# EAGLE design PCB-BI8-1x8SC3 (EAGLE 7.5.0)
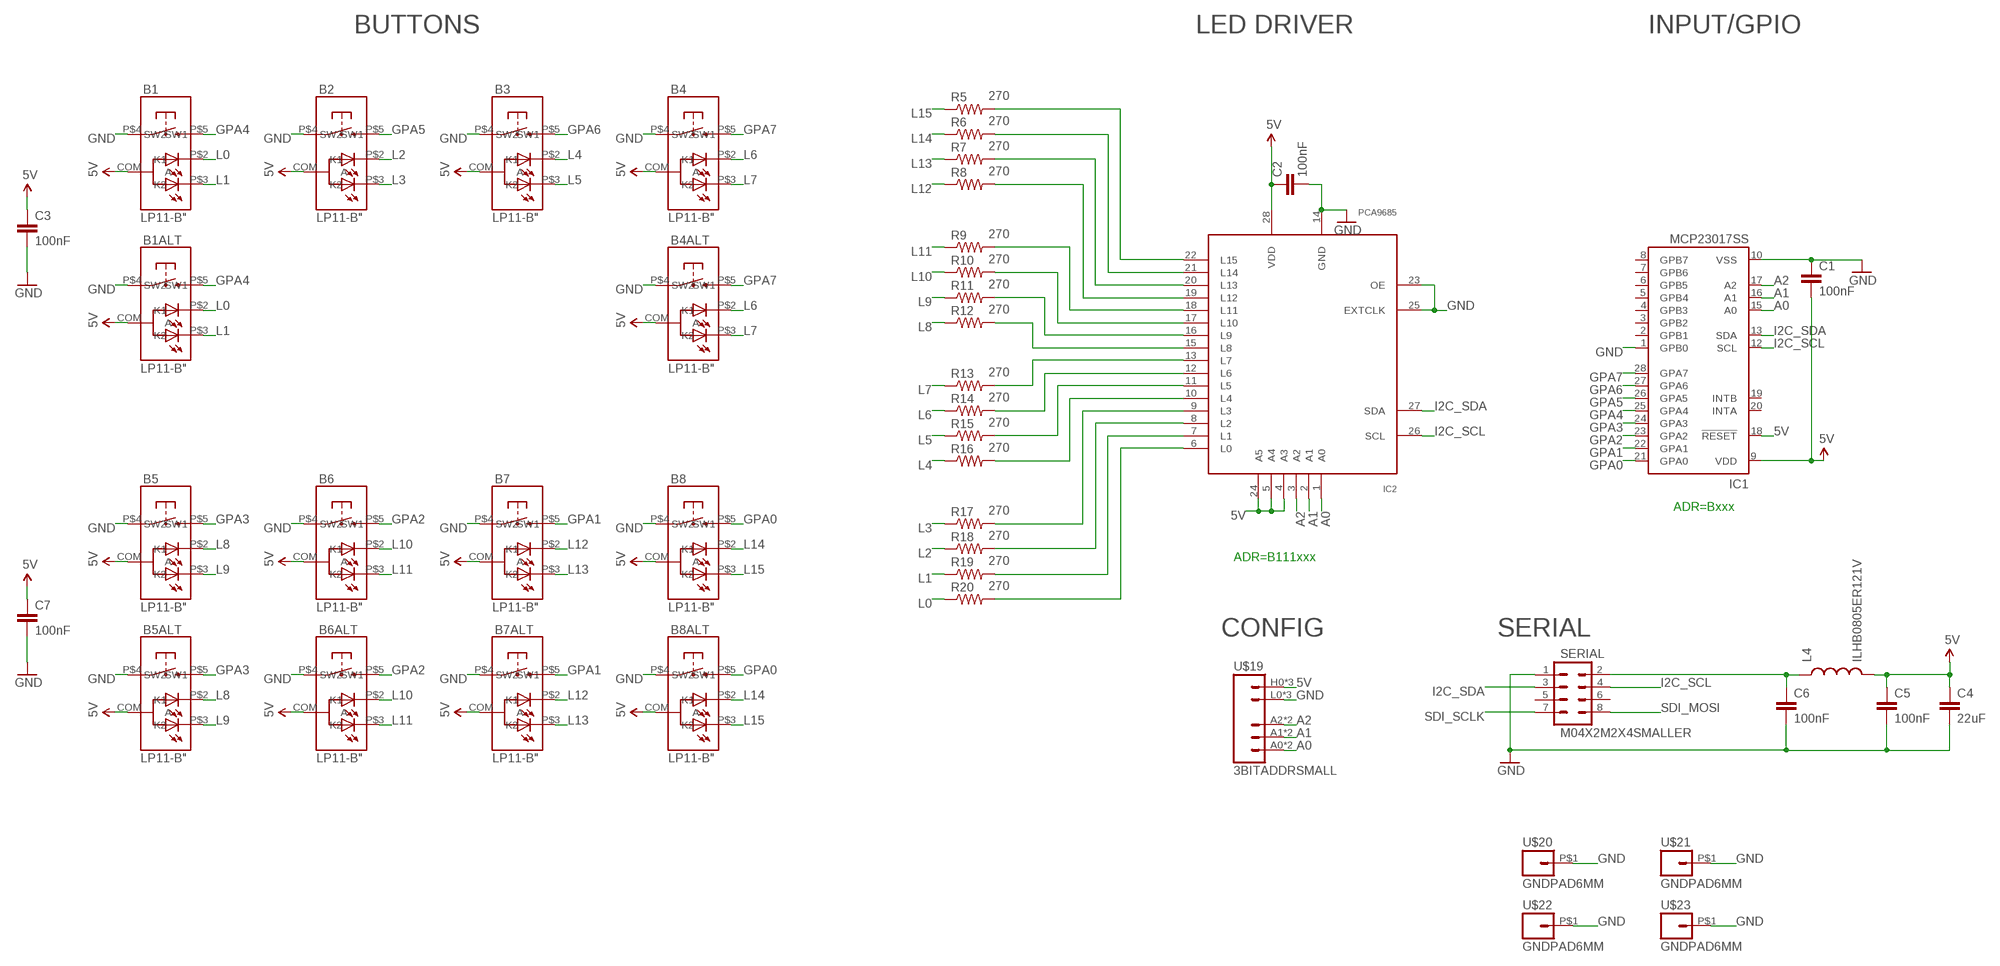
[diagram p0: schematic, sheet 1]

## Parts
B1  LP11-B"  [LP11]
B1ALT  LP11-B"  [LP11]
B2  LP11-B"  [LP11]
B3  LP11-B"  [LP11]
B4  LP11-B"  [LP11]
B4ALT  LP11-B"  [LP11]
B5  LP11-B"  [LP11]
B5ALT  LP11-B"  [LP11]
B6  LP11-B"  [LP11]
B6ALT  LP11-B"  [LP11]
B7  LP11-B"  [LP11]
B7ALT  LP11-B"  [LP11]
B8  LP11-B"  [LP11]
B8ALT  LP11-B"  [LP11]
C1  100nF  CAP0603-CAP  [0603-CAP]
C2  100nF  CAP0603-CAP  [0603-CAP]
C3  100nF  CAP0603-CAP  [0603-CAP]
C4  22uF  CAP0805  [0805]
C5  100nF  CAP0603-CAP  [0603-CAP]
C6  100nF  CAP0603-CAP  [0603-CAP]
C7  100nF  CAP0603-CAP  [0603-CAP]
IC1  MCP23017SS  [SSOP28]
IC2  PCA9685  [TSSOP28]
L4  ILHB0805ER121V  INDUCTOR0805  [0805]
R5  270  RESISTOR0603-RES  [0603-RES]
R6  270  RESISTOR0603-RES  [0603-RES]
R7  270  RESISTOR0603-RES  [0603-RES]
R8  270  RESISTOR0603-RES  [0603-RES]
R9  270  RESISTOR0603-RES  [0603-RES]
R10  270  RESISTOR0603-RES  [0603-RES]
R11  270  RESISTOR0603-RES  [0603-RES]
R12  270  RESISTOR0603-RES  [0603-RES]
R13  270  RESISTOR0603-RES  [0603-RES]
R14  270  RESISTOR0603-RES  [0603-RES]
R15  270  RESISTOR0603-RES  [0603-RES]
R16  270  RESISTOR0603-RES  [0603-RES]
R17  270  RESISTOR0603-RES  [0603-RES]
R18  270  RESISTOR0603-RES  [0603-RES]
R19  270  RESISTOR0603-RES  [0603-RES]
R20  270  RESISTOR0603-RES  [0603-RES]
SERIAL  M04X2M2X4SMALLER  [M2X4SMALLER]
U$19  3BITADDRSMALL  [3BITADDR_SMALL]
U$20  GNDPAD6MM  [3.2MMPAD6MM]
U$21  GNDPAD6MM  [3.2MMPAD6MM]
U$22  GNDPAD6MM  [3.2MMPAD6MM]
U$23  GNDPAD6MM  [3.2MMPAD6MM]

## Nets
5V [Power]: B1.COM(A) B1ALT.COM(A) B2.COM(A) B3.COM(A) B4.COM(A) B4ALT.COM(A) B5.COM(A) B5ALT.COM(A) B6.COM(A) B6ALT.COM(A) B7.COM(A) B7ALT.COM(A) B8.COM(A) B8ALT.COM(A) C1.2 C2.1 C3.1 C4.1 C5.1 C7.1 IC1.9(VDD) IC1.18(!RESET) IC2.4(A3) IC2.5(A4) IC2.24(A5) IC2.28(VDD) L4.2 U$19.H0(VCC) U$19.H1(VCC) U$19.H2(VCC)
A0: IC1.15(A0) IC2.1(A0) U$19.A0 U$19.AS0(A0)
A1: IC1.16(A1) IC2.2(A1) U$19.A1 U$19.AS1(A1)
A2: IC1.17(A2) IC2.3(A2) U$19.A2 U$19.AS2(A2)
GND [Power]: B1.P$4(SW1) B1ALT.P$4(SW1) B2.P$4(SW1) B3.P$4(SW1) B4.P$4(SW1) B4ALT.P$4(SW1) B5.P$4(SW1) B5ALT.P$4(SW1) B6.P$4(SW1) B6ALT.P$4(SW1) B7.P$4(SW1) B7ALT.P$4(SW1) B8.P$4(SW1) B8ALT.P$4(SW1) C1.1 C2.2 C3.2 C4.2 C5.2 C6.2 C7.2 IC1.1(GPB0) IC1.10(VSS) IC2.14(GND) IC2.23(OE) IC2.25(EXTCLK) SERIAL.1 U$19.L0(GND) U$19.L1(GND) U$19.L2(GND) U$20.P$1 U$21.P$1 U$22.P$1 U$23.P$1
GPA0: B8.P$5(SW2) B8ALT.P$5(SW2) IC1.21(GPA0)
GPA1: B7.P$5(SW2) B7ALT.P$5(SW2) IC1.22(GPA1)
GPA2: B6.P$5(SW2) B6ALT.P$5(SW2) IC1.23(GPA2)
GPA3: B5.P$5(SW2) B5ALT.P$5(SW2) IC1.24(GPA3)
GPA4: B1.P$5(SW2) B1ALT.P$5(SW2) IC1.25(GPA4)
GPA5: B2.P$5(SW2) IC1.26(GPA5)
GPA6: B3.P$5(SW2) IC1.27(GPA6)
GPA7: B4.P$5(SW2) B4ALT.P$5(SW2) IC1.28(GPA7)
I2C_SCL: IC1.12(SCL) IC2.26(SCL) SERIAL.4
I2C_SDA: IC1.13(SDA) IC2.27(SDA) SERIAL.3
L0: B1.P$2(K1) B1ALT.P$2(K1) R20.1
L1: B1.P$3(K2) B1ALT.P$3(K2) R19.1
L2: B2.P$2(K1) R18.1
L3: B2.P$3(K2) R17.1
L4: B3.P$2(K1) R16.1
L5: B3.P$3(K2) R15.1
L6: B4.P$2(K1) B4ALT.P$2(K1) R14.1
L7: B4.P$3(K2) B4ALT.P$3(K2) R13.1
L8: B5.P$2(K1) B5ALT.P$2(K1) R12.1
L9: B5.P$3(K2) B5ALT.P$3(K2) R11.1
L10: B6.P$2(K1) B6ALT.P$2(K1) R10.1
L11: B6.P$3(K2) B6ALT.P$3(K2) R9.1
L12: B7.P$2(K1) B7ALT.P$2(K1) R8.1
L13: B7.P$3(K2) B7ALT.P$3(K2) R7.1
L14: B8.P$2(K1) B8ALT.P$2(K1) R6.1
L15: B8.P$3(K2) B8ALT.P$3(K2) R5.1
N$1 [Power]: C6.1 L4.1 SERIAL.2
N$4: IC2.13(L7) R13.2
N$5: IC2.12(L6) R14.2
N$7: IC2.11(L5) R15.2
N$9: IC2.10(L4) R16.2
N$10: IC2.9(L3) R17.2
N$11: IC2.8(L2) R18.2
N$12: IC2.7(L1) R19.2
N$19: IC2.6(L0) R20.2
N$20: IC2.15(L8) R12.2
N$21: IC2.16(L9) R11.2
N$22: IC2.17(L10) R10.2
N$23: IC2.18(L11) R9.2
N$24: IC2.19(L12) R8.2
N$25: IC2.20(L13) R7.2
N$26: IC2.21(L14) R6.2
N$27: IC2.22(L15) R5.2
SDI_MOSI: SERIAL.8
SDI_SCLK: SERIAL.7
Unconnected: IC1.2(GPB1) IC1.3(GPB2) IC1.4(GPB3) IC1.5(GPB4) IC1.6(GPB5) IC1.7(GPB6) IC1.8(GPB7) IC1.19(INTB) IC1.20(INTA) SERIAL.5 SERIAL.6

## Notes on the sheet
- BUTTONS | LED DRIVER | INPUT/GPIO
- ADR=Bxxx
- ADR=B111xxx
- CONFIG | SERIAL

## Library data of the parts
B1 B1ALT B2-B4 B4ALT B5 B5ALT B6 B6ALT B7 B7ALT B8 B8ALT = SKAARHOJ:LP11-B
C1-C7 = SparkFun:CAP: Capacitor Standard 0603 ceramic capacitor, and 0.1" leaded capacitor.
IC1 = microchip:MCP23017: http://ww1.microchip.com/downloads/en/DeviceDoc/21952a.pdf Source: http://ww1.microchip.com/downloads/en/DeviceDoc/21952a.pdf; MF: MICROCHIP; MPN: MCP23017-E/SS; OC_FARNELL: 1467674; OC_NEWARK: 31K2960
IC2 = wsmith:PCA9685
L4 = SparkFun:INDUCTOR: Inductors Basic Inductor/Choke - 0603 and 1206. Footprints are not proven and vary greatly between part numbers.
R5-R20 = SparkFun:RESISTOR: Resistor Basic schematic elements and footprints for 0603, 1206, and PTH resistors.
SERIAL = SKAARHOJ:M04X2
U$19 = SKAARHOJ:3BITADDR
U$20-U$23 = SKAARHOJ:GNDPAD

## Net classes
0 default: width 0.203 mm, drill 0.406 mm, clearance 0.203 mm
1 Power: width 0.406 mm, drill 0.61 mm, clearance 0.203 mm

## Board
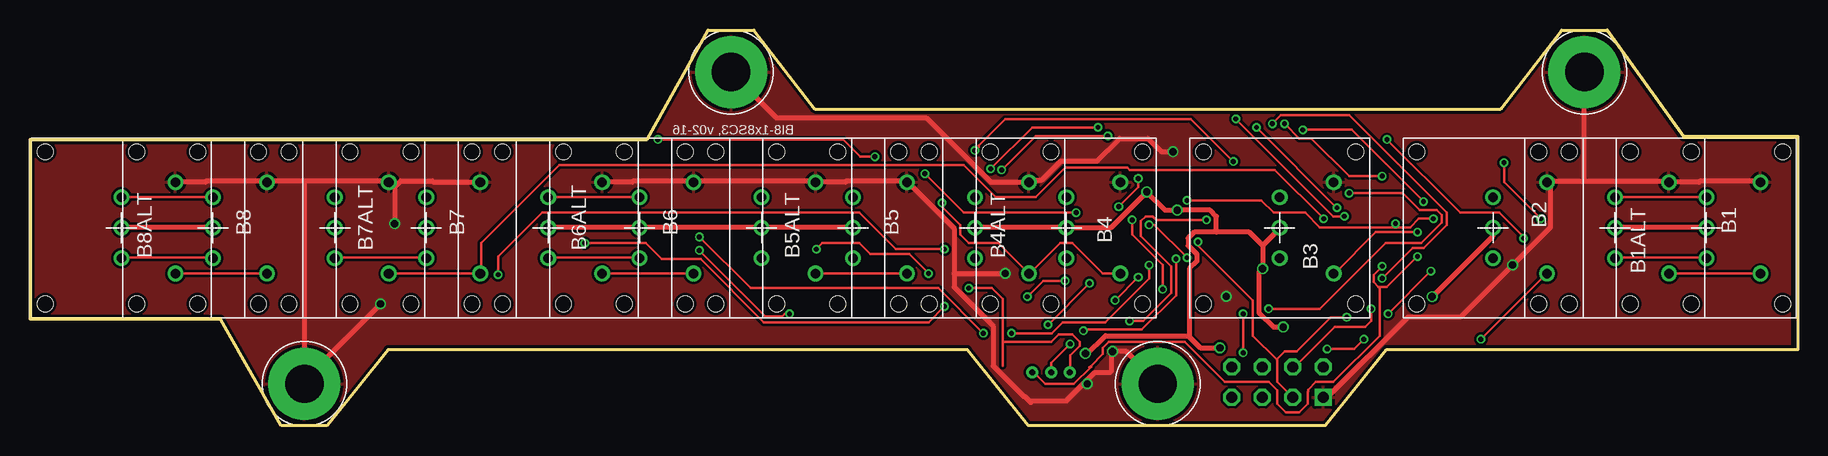
[diagram p1: board, top side]
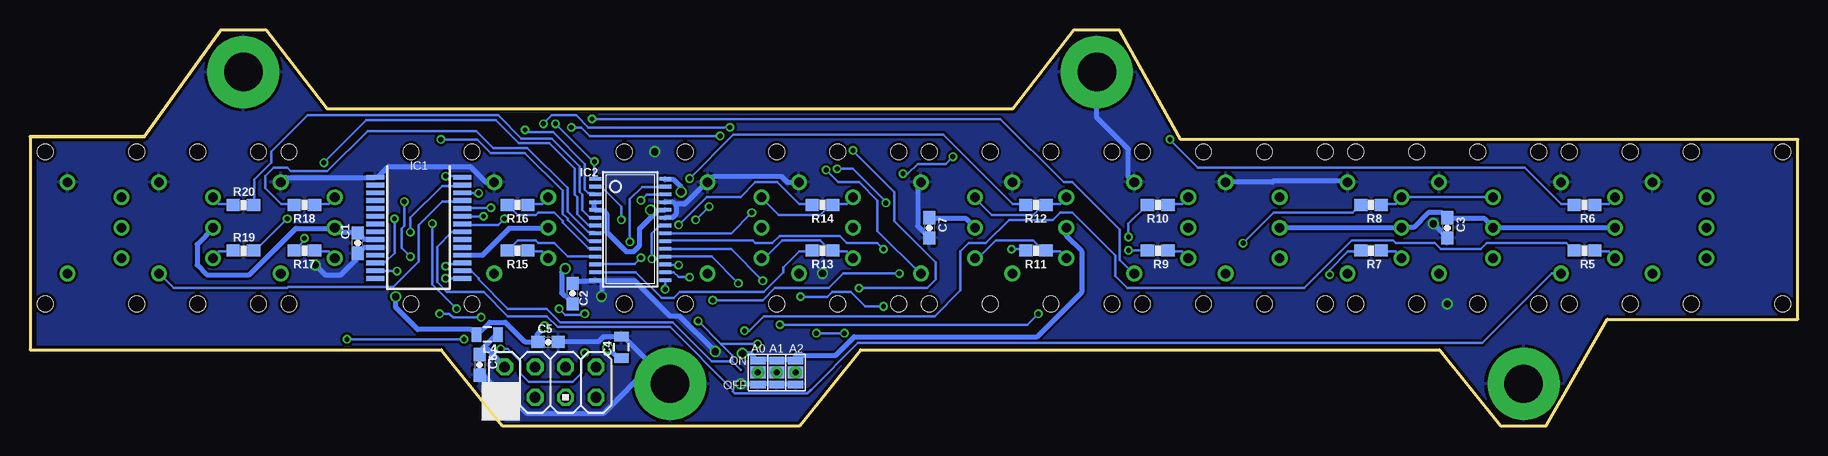
[diagram p2: board, bottom side, seen from below]

Size 147.32 x 33.02 mm. Coordinates in mm from the lower left corner, seen from the top.
Outline: 0,23.88 51.44,23.88 56.52,33.02 60.33,33.02 65.41,26.42 122.56,26.42 127.64,33.02 131.44,33.02 137.79,24.13 147.32,24.13 147.32,6.35 113.03,6.35 107.95,0 83.19,0 78.11,6.35 29.84,6.35 24.77,0 20.95,0 15.88,8.89 0,8.89 0,23.88
Copper layers (1*16): Top 0.035mm / dielectric 1.5mm / Bottom 0.035mm
Design rules "Fusion_eagle_rule_v1.1": minimum track width 6mil, minimum drill 12mil, track to track 6mil, track to pad 6mil, pad to pad 6mil, via to via 6mil, smd to smd 0mil, copper to edge 10mil, drill to drill 10mil, minimum pad ring 10mil, minimum via ring 6mil, stop-mask expansion 2mil, vias tented up to drill 100mil, thermal gap 10mil

### Footprints (pad centres in the part's own frame; a part is rotated, then mirrored left to right if it is on the bottom)
LP11 = drill 0.8: COM 0,0; P$2 0,2.54; P$3 0,-2.54; P$4 4.5,3.81; P$5 4.5,-3.81 | hole 1.3: -6.35,6.35; 6.35,6.35; 6.35,-6.35; -6.35,-6.35
0603-CAP = smd 1.1 x 1: 1 -0.85,0; 2 0.85,0
0805 = smd 0.8 x 1.2: 1 -0.9,0; 2 0.9,0
SSOP28 = smd 0.4 x 1.5: 1 -4.225,-3.625; 2 -3.575,-3.625; 3 -2.925,-3.625; 4 -2.275,-3.625; 5 -1.625,-3.625; 6 -0.975,-3.625; 7 -0.325,-3.625; 8 0.325,-3.625; 9 0.975,-3.625; 10 1.625,-3.625; 11 2.275,-3.625; 12 2.925,-3.625; 13 3.575,-3.625; 14 4.225,-3.625; 15 4.225,3.625; 16 3.575,3.625; 17 2.925,3.625; 18 2.275,3.625; 19 1.625,3.625; 20 0.975,3.625; 21 0.325,3.625; 22 -0.325,3.625; 23 -0.975,3.625; 24 -1.625,3.625; 25 -2.275,3.625; 26 -2.925,3.625; 27 -3.575,3.625; 28 -4.225,3.625
TSSOP28 = smd 0.305 x 0.991: 1 -4.225,-2.918; 2 -3.575,-2.918; 3 -2.925,-2.918; 4 -2.275,-2.918; 5 -1.625,-2.918; 6 -0.975,-2.918; 7 -0.325,-2.918; 8 0.325,-2.918; 9 0.975,-2.918; 10 1.625,-2.918; 11 2.275,-2.918; 12 2.925,-2.918; 13 3.575,-2.918; 14 4.225,-2.918; 15 4.225,2.918; 16 3.575,2.918; 17 2.925,2.918; 18 2.275,2.918; 19 1.625,2.918; 20 0.975,2.918; 21 0.325,2.918; 22 -0.325,2.918; 23 -0.975,2.918; 24 -1.625,2.918; 25 -2.275,2.918; 26 -2.925,2.918; 27 -3.575,2.918; 28 -4.225,2.918
0603-RES = smd 1.1 x 1: 1 -0.85,0; 2 0.85,0
M2X4SMALLER = drill 0.9 square: 1 -1.27,3.81 | drill 0.9 octagon: 2 1.27,3.81; 3 -1.27,1.27; 4 1.27,1.27; 5 -1.27,-1.27; 6 1.27,-1.27; 7 -1.27,-3.81; 8 1.27,-3.81
3BITADDR_SMALL = drill 0.5: A0 -1.565,0; A1 0,0; A2 1.565,0 | smd 1.27 x 1: AS0 -1.565,0; AS1 0,0; AS2 1.565,0 | smd 1.27 x 0.635: H0 -1.565,1; H1 0,1; H2 1.565,1; L0 -1.565,-1; L1 0,-1; L2 1.565,-1
3.2MMPAD6MM = drill 3.2 pad 6: P$1 0,0

### Placement (x,y rotation side)
B1  139.7,16.51 0 top
B1ALT  132.08,16.51 0 top
B2  121.92,16.51 0 top
B3  104.14,16.51 0 top
B4  86.36,16.51 0 top
B4ALT  78.74,16.51 0 top
B5  68.58,16.51 0 top
B5ALT  60.96,16.51 0 top
B6  50.8,16.51 0 top
B6ALT  43.18,16.51 0 top
B7  33.02,16.51 0 top
B7ALT  25.4,16.51 0 top
B8  15.24,16.51 0 top
B8ALT  7.62,16.51 0 top
C1  120.02,15.24 90 bottom
C2  102.11,11.02 90 bottom
C3  29.21,16.51 270 bottom
C4  98.04,6.55 90 bottom
C5  104.14,6.99 0 bottom
C6  109.86,5.08 270 bottom
C7  72.39,16.51 270 bottom
IC1  114.94,16.51 270 bottom
IC2  97.31,16.38 270 bottom
L4  109.22,7.62 180 bottom
R5  17.78,14.61 180 bottom
R6  17.78,18.41 180 bottom
R7  35.56,14.61 180 bottom
R8  35.56,18.41 180 bottom
R9  53.34,14.61 180 bottom
R10  53.34,18.41 180 bottom
R11  63.5,14.61 180 bottom
R12  63.5,18.41 180 bottom
R13  81.28,14.61 180 bottom
R14  81.28,18.41 180 bottom
R15  106.68,14.61 180 bottom
R16  106.68,18.41 180 bottom
R17  124.46,14.61 180 bottom
R18  124.46,18.41 180 bottom
R19  129.54,14.61 0 bottom
R20  129.54,18.41 0 bottom
SERIAL  103.96,3.63 90 bottom
U$19  85.09,4.45 0 bottom
U$20  22.86,3.5 0 top
U$21  93.98,3.5 0 top
U$22  129.54,29.52 0 top
U$23  58.42,29.52 0 top

### Tracks (layer width: path | path; a pad name or v marks a point on that pad's centre or on a via)
5V  (via drill 0.61)
  Top 0.406: B8ALT.COM 7.62,16.56 15.24,16.56 B8.COM | B6ALT.COM 43.18,16.56 50.8,16.56 B6.COM 50.9,16.56 60.86,16.56 B5ALT.COM 60.96,16.56 68.58,16.56 B5.COM | B4ALT.COM 78.74,16.56 86.26,16.56 B4.COM 86.36,16.56 90.12,16.56 v93.07,19.51 94.59,17.98 v95.61,17.98 98.35,17.98 98.86,17.48 98.86,16.15 | B1ALT.COM 132.08,16.56 139.7,16.56 B1.COM | v99.16,6.5 97.54,6.5 96.52,7.52 | 96.52,7.52 89.61,7.52 88.04,5.94 | 87.99,5.89 88.04,5.94 | 102.72,15.04 v102.72,13.11 102.41,12.8 102.41,9.45 103.63,8.23 v104.44,8.23 | 102.72,15.04 104.14,16.46 B3.COM | 98.86,16.15 101.6,16.15 102.72,15.04 | 98.86,16.15 97.03,16.15 96.52,15.65 96.52,15.04 97.23,14.33 97.23,13.72 96.62,13.11 96.62,7.62 96.52,7.52 | B2.COM 121.92,15.85 v116.84,10.77 | v87.95,6.03 88.04,5.94
  Bottom 0.406: B8.COM 15.24,16.56 25.3,16.56 B7ALT.COM 25.4,16.56 26.11,17.27 29.16,17.27 C3.1 29.36,17.48 29.67,17.78 30.79,17.78 32,16.56 33.02,16.56 B7.COM 33.12,16.56 43.18,16.56 B6ALT.COM | C7.1 72.34,17.27 69.29,17.27 68.58,16.56 B5.COM | 95.3,17.68 96.52,16.46 96.52,15.04 97.03,14.53 97.64,14.53 99.26,16.15 99.26,17.68 99.57,17.98 100.18,17.98 IC2.5 100.28,18.19 100.28,18.59 IC2.4 | 95.3,17.68 95,17.98 94.49,17.98 IC2.24 | v93.07,19.51 93.07,19.91 93.67,20.52 94.39,20.52 IC2.28 | v95.61,17.98 95.3,17.68 | IC1.9 119.48,15.54 119.99,16.05 C1.2 120.19,16.15 121.61,16.15 121.92,16.46 B2.COM 122.02,16.46 125.17,16.46 129.03,12.6 132.59,12.6 133.4,13.41 133.4,15.14 132.08,16.46 B1ALT.COM | v99.16,6.5 98.35,5.69 98.04,5.69 C4.1 | v102.72,13.11 103.02,12.8 103.02,11.07 102.82,10.87 102.72,10.87 102.11,10.26 C2.1 | IC1.18 111.25,14.22 109.63,14.22 107.39,16.46 104.14,16.46 B3.COM | v104.44,8.23 105.05,7.62 105.05,7.21 C5.1 105.05,7.01 106.07,7.01 107.7,8.64 109.02,8.64 110.03,7.62 L4.2 110.24,7.72 110.54,8.03 115.01,8.03 116.84,9.86 v116.84,10.77 | B5ALT.COM 60.96,15.85 59.64,14.53 59.64,11.18 63.4,7.42 78.64,7.42 80.16,5.89 83.5,5.89 | 83.52,5.89 83.5,5.89 | 83.5,5.89 83.5,5.56 U$19.H2 83.66,5.56 85.09,5.56 U$19.H1 85.25,5.56 86.52,5.56 U$19.H0 86.84,5.56 87.31,6.03 v87.95,6.03
A0  (via drill 0.41)
  Top 0.203: v103.53,25.2 104.24,25.91 109.93,25.91 118.06,17.78 118.06,16.76 116.13,14.83 115.21,14.83 v112.67,12.29 | 81.08,6.99 81.08,10.57 80.16,11.48 v78.23,11.48 | 81.08,6.99 81.08,4.98 | v78.74,22.96 79.05,23.27 79.05,23.37 81.28,25.6 96.72,25.6 v100.28,22.05 | 81.08,6.99 85.09,6.99 85.72,7.62 86.84,7.62 87.47,6.99 87.47,6.67 86.68,5.87 86.68,4.45 U$19.AS0
  Bottom 0.203: v103.53,25.2 100.33,22 | 100.33,22 100.28,21.95 100.28,20.62 IC2.1 | v112.67,12.29 111.35,12.29 IC1.15 | v78.23,11.48 72.54,11.48 71.83,12.19 71.83,13.61 75.29,17.07 75.29,19.51 v78.74,22.96 | v100.28,22.05 100.33,22 | 86.68,4.45 U$19.AS0
A1  (via drill 0.41)
  Top 0.203: v98.04,17.17 93.88,17.17 93.57,17.48 92.96,17.48 92.56,17.07 92.56,15.85 95.1,13.31 95.1,11.07 92.76,8.74 v91.64,8.74 | U$19.AS1 85.09,5.24 v86.68,6.83
  Bottom 0.203: v98.04,17.17 98.04,18.29 99.67,19.91 100.18,19.91 IC2.2 | 89.71,6.81 88.8,5.89 88.8,5.38 | 89.71,6.81 v91.64,8.74 | 88.09,4.67 88.8,5.38 | 88.8,5.38 90.53,5.38 93.78,8.64 103.12,8.64 104.24,9.75 107.49,9.75 109.93,12.19 109.93,12.29 110.54,12.9 111.25,12.9 IC1.16 | v86.68,6.83 89.69,6.83 89.71,6.81
A2  (via drill 0.41)
  Top 0.203: v106.07,24.69 110.13,24.69 v116.13,18.69 | v115.62,14.12 113.08,11.58 112.47,11.58 | 112.47,11.58 112.37,11.58 111.96,11.99 111.96,12.6 v112.67,13.31 | 88.38,4.97 89.41,5.99 89.41,6.5 89.92,7.01 96.22,7.01 99.57,3.66 103.23,3.66 103.94,2.95 103.94,1.83 104.65,1.12 105.77,1.12 106.48,1.83 106.48,2.85 106.52,2.86 106.52,3.02 107.16,3.65 107.31,3.65 107.31,3.66 | 88.38,4.97 88.29,4.88 | 107.31,3.66 108.61,3.66 112.47,7.52 112.47,11.58 | 107.31,3.66 107.29,3.66 | U$19.AS2 83.66,4.45 84.61,3.49 87,3.49 88.42,4.92 88.38,4.97
  Bottom 0.203: v106.07,24.69 105.87,24.49 103.73,24.49 101.09,21.84 101.09,19.71 100.79,19.41 100.28,19.41 IC2.3 | v116.13,18.69 116.13,16.66 116.33,16.46 116.33,14.83 v115.62,14.12 | v112.67,13.31 112.37,13.31 112.17,13.51 111.35,13.51 IC1.17 | 83.66,4.45 U$19.AS2
GND  (via drill 0.6, 0.61)
  Top 0.406: U$21.P$1 93.98,3.56 91.34,6.2 v90.22,6.2 90.12,6.1 90.12,4.57 90.01,4.45 88.74,4.45 87.87,3.57 | B1.P$4 144.17,20.32 144.07,20.42 139.19,20.42 139.09,20.32 B1ALT.P$4 136.45,20.42 129.54,20.42 | 129.54,20.42 127,20.42 126.8,20.22 B2.P$4 126.49,20.32 126.69,20.12 126.69,16.56 v123.55,13.41 119.18,9.04 114.81,9.04 108.2,2.44 107.8,2.44 SERIAL.1 | 129.54,20.42 U$22.P$1 | U$23.P$1 58.42,29.46 62.18,25.7 74.68,25.7 80.06,20.32 B4ALT.P$4 83.34,20.48 84.3,20.48 85.88,22.07 88.9,22.07 90.81,23.97 93.19,23.97 94.3,22.86 v95.25,22.86 | B6ALT.P$4 50.19,20.32 50.29,20.42 55.17,20.42 55.27,20.32 B6.P$4 55.47,20.42 65.33,20.42 B5ALT.P$4 67.97,20.32 68.07,20.42 72.95,20.42 73.05,20.32 B5.P$4 73.25,20.22 77.01,16.46 77.01,12.7 | B8ALT.P$4 14.63,20.32 14.73,20.42 19.61,20.42 19.71,20.32 B8.P$4 19.91,20.42 22.86,20.42 | v30.38,16.87 30.38,19.91 29.97,20.32 B7ALT.P$4 | B7.P$4 33.63,20.32 33.53,20.42 30.89,20.42 30.48,20.02 B7ALT.P$4 | 22.86,20.42 29.77,20.42 B7ALT.P$4 | 22.86,20.42 U$20.P$1 23.02,3.97 v29.21,10.16 | 83.39,1.95 82.91,2.44 82.8,2.44 80.26,4.98 80.26,8.33 77.01,11.58 77.01,12.7 | 83.39,1.95 83.41,1.93 | 77.01,12.7 v81.28,12.7 | 87.87,3.57 86.36,2.06 83.5,2.06 83.39,1.95 | v88.11,3.49 87.95,3.49 87.87,3.57
  Bottom 0.406: C6.2 109.83,4.17 109.53,4.17 107.8,2.44 SERIAL.1 107.59,2.34 107.19,2.34 105.87,1.02 99.57,1.02 95.61,4.98 U$21.P$1 93.98,3.56 97.74,7.32 97.94,7.32 C4.2 98.04,7.42 99.57,7.42 99.97,7.01 103.23,7.01 C5.2 | C2.2 102.11,11.89 101.91,12.09 100.28,12.09 IC2.14 100.08,12.09 99.69,12.09 | 99.69,12.09 96.93,12.09 93.98,9.14 93.17,9.14 v90.22,6.2 | v123.55,13.41 122.73,12.6 121.41,12.6 120.09,13.92 120.09,14.33 C1.1 119.52,14.88 IC1.10 | B2.P$4 126.39,20.32 125.98,20.73 IC1.1 118.36,20.73 117.45,21.64 110.64,21.64 109.32,20.32 B3.P$4 | 93.47,18.39 93.47,17.68 93.78,17.37 94.39,17.37 IC2.23 | 93.47,18.39 93.78,18.69 94.39,18.69 IC2.25 | 93.47,18.39 93.37,18.49 92.76,18.49 90.93,20.32 B4.P$4 90.73,20.42 90.32,20.83 84.73,20.83 84.23,20.32 B4ALT.P$4 | C7.2 72.44,15.75 73.36,16.66 73.36,20.12 73.15,20.32 B5.P$4 | v30.38,16.87 29.26,15.75 C3.2 | B6ALT.P$4 43.79,20.32 43.69,20.42 37.69,20.42 37.59,20.32 B7.P$4 | U$23.P$1 58.42,25.7 55.78,23.06 55.78,20.73 55.37,20.32 B6.P$4 | U$19.L2 83.66,3.49 85.09,3.49 U$19.L1 85.25,3.49 86.52,3.49 U$19.L0 86.84,3.49 v88.11,3.49 | 99.69,12.09 v99.69,10.79
  pour Top: 0,0 146.69,0 146.69,33.66 0,33.66
  pour Bottom: 0,0 146.69,0 146.69,33.66 0,33.66
GPA0
  Top 0.203: B8.P$5 B8ALT.P$5
  Bottom 0.203: 82.23,3.01 78.33,6.91 26.31,6.91 20.52,12.7 B8.P$5 | 82.23,3.01 82.3,2.95 | IC1.21 111.35,16.15 112.17,16.15 113.39,14.94 113.39,11.99 112.57,11.18 109.53,11.18 107.49,9.14 104.24,9.14 103.33,8.23 93.98,8.23 88.7,2.95 88.74,2.86 88.58,2.7 82.55,2.7 82.23,3.02 82.23,3.01
GPA1  (via drill 0.41)
  Top 0.203: v107.8,17.27 103.73,21.34 91.64,21.34 91.44,21.54 86.26,21.54 83.82,19.1 80.47,19.1 77.83,21.74 44.09,21.74 37.59,15.24 37.59,12.7 B7.P$5 B7ALT.P$5
  Bottom 0.203: v107.8,17.27 108.31,16.76 111.25,16.76 IC1.22
GPA2  (via drill 0.41)
  Top 0.203: v109.53,17.48 108.61,17.48 v100.48,25.6 | B6.P$5 B6ALT.P$5
  Bottom 0.203: v109.53,17.48 111.25,17.48 IC1.23 | v100.48,25.6 66.45,25.6 61.16,20.32 60.45,20.32 56.49,16.36 56.49,13.82 55.37,12.7 B6.P$5
GPA3  (via drill 0.41)
  Top 0.203: v102.21,24.89 v108.92,18.19 | v89.81,24.18 83.82,24.18 v80.97,21.34 | B5.P$5 B5ALT.P$5
  Bottom 0.203: v108.92,18.19 111.25,18.19 IC1.24 | v102.21,24.89 101.4,24.89 100.69,24.18 v89.81,24.18 | v80.97,21.34 79.96,20.32 78.23,20.32 76.71,18.8 76.71,16.26 73.15,12.7 B5.P$5
GPA4
  Top 0.203: B1ALT.P$5 B1.P$5
  Bottom 0.203: IC1.25 111.35,18.69 112.98,18.69 114.91,16.76 114.91,13.72 117.04,11.58 125.78,11.58 125.88,11.48 135.33,11.48 136.55,12.7 B1ALT.P$5
GPA5  (via drill 0.41)
  Top 0.203: v109.93,19.41 114.4,19.41 115.82,17.98 117.25,17.98 117.65,17.58 117.65,16.97 115.93,15.24 112.98,15.24 107.49,9.75 v103.23,9.75 | v101.09,6.1 v101.09,9.35 | v108.1,6.4 110.34,6.4 v111.15,7.21 | v120.9,7.21 126.39,12.7 B2.P$5
  Bottom 0.203: v109.93,19.41 111.25,19.41 IC1.26 | v103.23,9.75 102.72,9.25 101.19,9.25 v101.09,9.35 | v101.09,6.1 101.09,5.79 101.4,5.49 101.4,4.37 102.11,3.66 105.77,3.66 106.48,4.37 106.48,5.38 107.49,6.4 v108.1,6.4 | v120.9,7.21 v111.15,7.21
GPA6  (via drill 0.41)
  Top 0.203: v115.62,16.15 112.17,16.15 108.71,12.7 B3.P$5
  Bottom 0.203: v115.62,16.15 115.62,17.37 112.98,20.02 111.35,20.02 IC1.27
GPA7  (via drill 0.41)
  Top 0.203: v112.67,20.83 109.93,20.83 106.78,23.98 105.77,23.98 v104.55,25.2 | v89,24.89 83.52,24.89 v80.06,21.44 | v76,18.59 76,18.29 77.52,16.76 77.52,15.95 78.23,15.24 80.67,15.24 83.21,12.7 B4ALT.P$5 83.31,12.7 85.85,15.24 86.87,15.24 89.41,12.7 B4.P$5
  Bottom 0.203: v112.67,20.83 111.35,20.83 IC1.28 | v104.55,25.2 103.83,25.91 101.8,25.91 100.79,24.89 v89,24.89 | v80.06,21.44 78.74,21.44 76,18.69 v76,18.59
I2C_SCL  (via drill 0.41)
  Top 0.203: v96.42,18.8 102.62,18.8 103.63,17.78 106.27,17.78 107.49,16.56 113.79,16.56 | 113.79,16.56 115.01,16.56 115.72,17.27 v116.94,17.27 | v111.76,9.75 111.76,8.74 111.25,8.23 108.71,8.23 105.46,4.98 105.26,4.98 SERIAL.4 | 113.79,16.56 v113.79,16.87
  Bottom 0.203: v96.42,18.8 95.91,19.3 94.49,19.3 IC2.26 | v116.94,17.27 116.94,14.43 117.75,13.61 118.47,13.61 IC1.12 | v111.76,9.75 113.79,11.79 v113.79,16.87
I2C_SDA  (via drill 0.41)
  Top 0.203: v97.33,15.34 97.33,15.04 101.91,10.46 101.91,7.52 103.89,5.54 | 103.89,5.54 103.94,5.49 103.94,3.66 SERIAL.3 | v113.18,9.35 v116.74,12.9 | v109.73,9.04 108.41,9.04 105.56,6.2 104.55,6.2 103.89,5.54
  Bottom 0.203: v97.33,15.34 97.33,18.9 96.32,19.91 94.49,19.91 IC2.27 | v116.74,12.9 118.47,12.9 IC1.13 | v113.18,9.35 112.37,9.35 112.06,9.04 v109.73,9.04
L0
  Top 0.203: B1ALT.P$2 132.08,19.1 139.7,19.1 B1.P$2
  Bottom 0.203: R20.1 130.45,18.49 131.57,18.49 132.08,19 B1ALT.P$2
L1
  Top 0.203: B1ALT.P$3 132.08,14.02 139.7,14.02 B1.P$3
  Bottom 0.203: R19.1 130.45,14.53 131.57,14.53 132.08,14.02 B1ALT.P$3
L2
  Bottom 0.203: R18.1 123.55,18.49 122.43,18.49 121.92,19 B2.P$2
L3
  Bottom 0.203: R17.1 123.55,14.53 122.43,14.53 121.92,14.02 B2.P$3
L4
  Bottom 0.203: R16.1 105.77,18.49 104.65,18.49 104.14,19 B3.P$2
L5
  Bottom 0.203: R15.1 105.77,14.53 104.65,14.53 104.14,14.02 B3.P$3
L6
  Bottom 0.203: B4ALT.P$2 78.74,19 79.25,18.49 80.37,18.49 R14.1 80.47,18.39 80.67,18.39 81.48,17.58 84.94,17.58 86.36,19 B4.P$2
L7
  Bottom 0.203: B4ALT.P$3 78.74,14.02 79.25,14.53 80.37,14.53 R13.1 80.47,14.63 80.67,14.63 81.48,15.44 84.63,15.44 86.06,14.02 86.36,14.02 B4.P$3
L8
  Bottom 0.203: B5ALT.P$2 60.96,19 61.47,18.49 62.59,18.49 R12.1 62.69,18.39 62.89,18.39 63.7,17.58 67.16,17.58 68.58,19 B5.P$2
L9
  Bottom 0.203: B5ALT.P$3 60.96,14.02 61.47,14.53 62.59,14.53 R11.1 62.69,14.63 62.89,14.63 63.7,15.44 66.85,15.44 68.28,14.02 68.58,14.02 B5.P$3
L10
  Top 0.203: B6ALT.P$2 43.18,19.1 50.8,19.1 B6.P$2
  Bottom 0.203: R10.1 52.43,18.49 51.31,18.49 50.8,19 B6.P$2
L11
  Top 0.203: B6ALT.P$3 43.18,14.02 50.8,14.02 B6.P$3
  Bottom 0.203: R9.1 52.43,14.53 51.31,14.53 50.8,14.02 B6.P$3
L12
  Bottom 0.203: R8.1 34.65,18.49 33.53,18.49 33.02,19 B7.P$2 33.02,19.1 25.4,19.1 B7ALT.P$2
L13
  Top 0.203: B7ALT.P$3 25.4,14.02 33.02,14.02 B7.P$3
  Bottom 0.203: R7.1 34.65,14.53 33.53,14.53 33.02,14.02 B7.P$3
L14
  Top 0.203: B8ALT.P$2 7.62,19.1 15.24,19.1 B8.P$2
  Bottom 0.203: R6.1 16.87,18.49 15.75,18.49 15.24,19 B8.P$2
L15
  Top 0.203: B8ALT.P$3 7.62,14.02 15.24,14.02 B8.P$3
  Bottom 0.203: R5.1 16.87,14.53 15.75,14.53 15.24,14.02 B8.P$3
N$1
  Bottom 0.406: 109.42,6.6 108.41,7.62 L4.1 | 109.42,6.6 109.83,6.2 109.83,5.99 C6.1 | 109.42,6.6 107.8,4.98 SERIAL.2
N$4
  Bottom 0.203: IC2.13 100.18,12.8 96.83,12.8 94.69,10.67 93.67,10.67 93.17,11.18 86.16,11.18 84.53,12.8 84.53,13.21 83.21,14.53 82.19,14.53 R13.2
N$5  (via drill 0.41)
  Top 0.203: v96.42,14.02 93.67,16.76 v93.27,16.76
  Bottom 0.203: v96.42,14.02 96.93,13.51 100.18,13.51 IC2.12 | v93.27,16.76 90.93,19.1 88.09,19.1 86.87,20.32 85.04,20.32 83.21,18.49 82.19,18.49 R14.2
N$7
  Bottom 0.203: IC2.11 100.28,14.12 102.51,14.12 103.63,15.24 104.95,15.24 105.16,15.44 106.68,15.44 107.49,14.63 R15.2
N$9
  Bottom 0.203: IC2.10 100.28,14.83 100.79,14.83 102.92,16.97 102.92,17.07 103.63,17.78 104.95,17.78 105.16,17.58 106.68,17.58 107.49,18.39 R16.2
N$10  (via drill 0.41)
  Top 0.203: v113.08,23.88 119.18,17.78 122.43,17.78 124.46,15.75 v124.46,15.65
  Bottom 0.203: v113.08,23.88 110.03,23.88 108.92,22.76 106.07,22.76 102.92,19.61 102.92,17.68 102.51,17.27 102.51,17.17 100.79,15.44 100.28,15.44 IC2.9 | v124.46,15.65 124.46,15.44 125.27,14.63 R17.2
N$11
  Bottom 0.203: IC2.8 100.28,16.15 100.79,16.15 102.51,17.88 102.51,19.81 105.87,23.16 108.71,23.16 110.13,24.59 119.18,24.59 122.53,21.23 125.58,21.23 125.88,21.54 127,21.54 127.71,20.83 127.71,19.81 126.39,18.49 125.37,18.49 R18.2
N$12  (via drill 0.41)
  Top 0.203: v122.83,21.95 122.83,20.32 v125.88,17.27
  Bottom 0.203: v122.83,21.95 119.28,25.5 108.51,25.5 106.58,23.57 104.04,23.57 101.91,21.44 101.91,19.3 101.7,19.1 101.7,17.68 100.79,16.76 100.28,16.76 IC2.7 | v125.88,17.27 128.63,14.53 R19.2
N$19
  Bottom 0.203: IC2.6 100.28,17.37 100.69,17.37 101.3,17.98 101.3,19.3 101.5,19.51 101.5,21.64 103.83,23.98 106.38,23.98 108.31,25.91 124.16,25.91 127.2,22.86 127.2,21.95 128.63,20.52 128.63,18.49 R20.2
N$20  (via drill 0.41)
  Top 0.203: v94.39,11.38 94.39,13.41 91.85,15.95 v91.85,17.17 | v90.73,18.29 92.35,19.91 v92.35,20.62
  Bottom 0.203: v94.39,11.38 94.39,12.09 IC2.15 | v90.73,18.29 v91.85,17.17 | v92.35,20.62 88.7,24.28 71.22,24.28 65.43,18.49 64.41,18.49 R12.2
N$21  (via drill 0.41)
  Top 0.203: v90.42,10.46 v92.35,12.39 | v74.88,12.7 73.25,14.33 70,14.33 69.09,15.24 66.04,15.24 v65.53,14.73
  Bottom 0.203: v92.35,12.39 93.27,12.39 93.67,12.8 IC2.16 | v90.42,10.46 86.26,10.46 85.24,11.48 80.77,11.48 79.55,12.7 v74.88,12.7 | v65.53,14.73 64.52,14.73 64.41,14.63 R11.2
N$22  (via drill 0.41)
  Top 0.203: v93.27,13.41 93.27,12.29 89.61,8.64 86.06,8.64 85.14,7.72 v81.79,7.72 | v79.45,7.72 75.69,11.48 60.05,11.48 v55.78,15.75
  Bottom 0.203: v93.27,13.41 94.39,13.41 IC2.17 | v79.45,7.72 v81.79,7.72 | v55.78,15.75 55.78,16.87 54.25,18.39 R10.2
N$23  (via drill 0.41)
  Top 0.203: v84.84,8.43 v88.29,11.89 | v63.3,9.35 62.89,9.35 62.69,9.14 61.27,9.14 v55.78,14.63
  Bottom 0.203: v88.29,11.89 90.53,14.12 94.39,14.12 IC2.18 | v84.84,8.43 64.21,8.43 v63.3,9.35 | v55.78,14.63 54.25,14.63 R9.2
N$24  (via drill 0.41)
  Top 0.203: v86.26,12.09 84.43,12.09 v83.11,10.77 | v76.2,9.96 74.88,8.64 61.16,8.64 55.88,13.92 52.63,13.92 51.31,15.24 v46.23,15.24
  Bottom 0.203: v86.26,12.09 88.9,14.73 94.39,14.73 IC2.19 | v83.11,10.77 80.87,10.77 80.47,11.18 78.94,11.18 77.72,9.96 v76.2,9.96 | v46.23,15.24 43.69,17.78 37.08,17.78 36.47,18.39 R8.2
N$25  (via drill 0.41)
  Top 0.203: v76.2,14.73 72.14,14.73 69.09,17.78 42.67,17.78 39.01,14.12 v39.01,12.6
  Bottom 0.203: v76.2,14.73 76.71,15.24 79.25,15.24 79.86,15.85 84.84,15.85 85.45,15.24 86.87,15.24 87.07,15.44 94.39,15.44 IC2.20 | v39.01,12.6 39.01,13.01 37.49,14.53 36.47,14.53 R7.2
N$26  (via drill 0.41)
  Top 0.203: v87.17,17.78 77.83,17.78 v74.57,21.03 | v70.41,22.45 69.19,22.45 67.77,23.88 v52.32,23.88
  Bottom 0.203: v87.17,17.78 88.9,16.05 IC2.21 | v74.57,21.03 74.17,21.03 73.36,21.84 71.02,21.84 v70.41,22.45 | v52.32,23.88 49.99,21.54 22.76,21.54 19.71,18.49 18.69,18.49 R6.2
N$27  (via drill 0.41)
  Top 0.203: v95.5,13.92 95.5,10.87 92.66,8.03 87.88,8.03 v87.78,7.92
  Bottom 0.203: v95.5,13.92 95.5,16.05 94.89,16.66 94.49,16.66 IC2.22 | v87.78,7.92 87.38,7.92 86.16,9.14 71.93,9.14 69.8,11.28 69.8,14.53 69.09,15.24 67.67,15.24 65.73,17.17 62.08,17.17 61.47,17.78 60.45,17.78 56.9,14.22 56.9,12.5 55.88,11.48 41.15,11.48 37.19,15.44 33.73,15.44 33.53,15.24 30.28,15.24 29.77,14.73 26.42,14.73 25.91,15.24 19.3,15.24 18.69,14.63 R5.2

### Text on the board
_tsilk: BI8-1x8SC3, v02-16